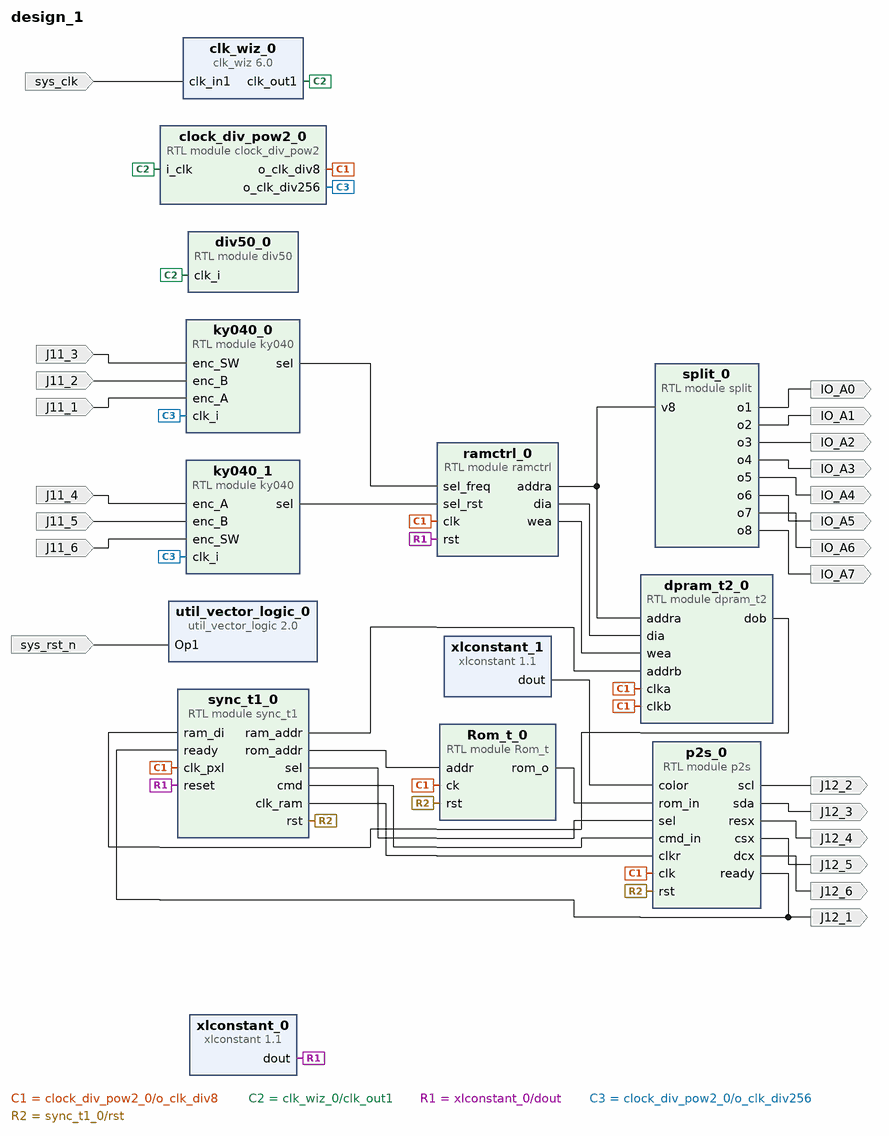
[diagram p0: block diagram of the top level]
# Vivado block design design_1, xc7k325tffg676-1, Vivado 2019.1
create_bd_design design_1

create_bd_port -dir I sys_clk
create_bd_port -dir I sys_rst_n
create_bd_port -dir I J11_1
create_bd_port -dir I J11_2
create_bd_port -dir I J11_3
create_bd_port -dir I J11_4
create_bd_port -dir I J11_5
create_bd_port -dir I J11_6
create_bd_port -dir O IO_A0
create_bd_port -dir O IO_A1
create_bd_port -dir O IO_A2
create_bd_port -dir O IO_A3
create_bd_port -dir O IO_A4
create_bd_port -dir O IO_A5
create_bd_port -dir O IO_A6
create_bd_port -dir O IO_A7
create_bd_port -dir O J12_1
create_bd_port -dir O J12_2
create_bd_port -dir O J12_3
create_bd_port -dir O J12_4
create_bd_port -dir O J12_5
create_bd_port -dir O J12_6

create_bd_cell -type module -reference Rom_t Rom_t_0
create_bd_cell -type module -reference dpram_t2 dpram_t2_0
create_bd_cell -type module -reference ramctrl ramctrl_0
create_bd_cell -type ip -vlnv xilinx.com:ip:clk_wiz:6.0 clk_wiz_0
create_bd_cell -type ip -vlnv xilinx.com:ip:util_vector_logic:2.0 util_vector_logic_0
set_property -dict {CONFIG.C_OPERATION not} [get_bd_cells util_vector_logic_0]
create_bd_cell -type module -reference clock_div_pow2 clock_div_pow2_0
create_bd_cell -type module -reference div50 div50_0
create_bd_cell -type ip -vlnv xilinx.com:ip:xlconstant:1.1 xlconstant_0
set_property -dict {CONFIG.CONST_VAL 0} [get_bd_cells xlconstant_0]
create_bd_cell -type module -reference ky040 ky040_0
create_bd_cell -type module -reference ky040 ky040_1
create_bd_cell -type module -reference split split_0
create_bd_cell -type module -reference p2s p2s_0
create_bd_cell -type ip -vlnv xilinx.com:ip:xlconstant:1.1 xlconstant_1
set_property -dict {CONFIG.CONST_VAL 0 CONFIG.CONST_WIDTH 16} [get_bd_cells xlconstant_1]
create_bd_cell -type module -reference sync_t1 sync_t1_0

# ---- connections ----

connect_bd_net [get_bd_ports sys_clk] [get_bd_pins clk_wiz_0/clk_in1]
connect_bd_net [get_bd_ports sys_rst_n] [get_bd_pins util_vector_logic_0/Op1]
connect_bd_net [get_bd_pins clock_div_pow2_0/o_clk_div8] \
  [get_bd_pins ramctrl_0/clk] [get_bd_pins dpram_t2_0/clka] [get_bd_pins dpram_t2_0/clkb] [get_bd_pins Rom_t_0/ck] \
  [get_bd_pins p2s_0/clk] [get_bd_pins sync_t1_0/clk_pxl]
connect_bd_net [get_bd_pins clk_wiz_0/clk_out1] [get_bd_pins div50_0/clk_i] [get_bd_pins clock_div_pow2_0/i_clk]
connect_bd_net [get_bd_pins xlconstant_0/dout] [get_bd_pins ramctrl_0/rst] [get_bd_pins sync_t1_0/reset]
connect_bd_net -net J11_4_1 [get_bd_ports J11_4] [get_bd_pins ky040_1/enc_A]
connect_bd_net -net J11_5_1 [get_bd_ports J11_5] [get_bd_pins ky040_1/enc_B]
connect_bd_net -net J11_6_1 [get_bd_ports J11_6] [get_bd_pins ky040_1/enc_SW]
connect_bd_net -net J11_3_1 [get_bd_ports J11_3] [get_bd_pins ky040_0/enc_SW]
connect_bd_net -net J11_2_1 [get_bd_ports J11_2] [get_bd_pins ky040_0/enc_B]
connect_bd_net -net J11_1_1 [get_bd_ports J11_1] [get_bd_pins ky040_0/enc_A]
connect_bd_net [get_bd_pins clock_div_pow2_0/o_clk_div256] [get_bd_pins ky040_0/clk_i] [get_bd_pins ky040_1/clk_i]
connect_bd_net [get_bd_pins ky040_0/sel] [get_bd_pins ramctrl_0/sel_freq]
connect_bd_net [get_bd_pins ky040_1/sel] [get_bd_pins ramctrl_0/sel_rst]
connect_bd_net [get_bd_pins ramctrl_0/addra] [get_bd_pins dpram_t2_0/addra] [get_bd_pins split_0/v8]
connect_bd_net [get_bd_pins ramctrl_0/dia] [get_bd_pins dpram_t2_0/dia]
connect_bd_net [get_bd_pins sync_t1_0/ram_addr] [get_bd_pins dpram_t2_0/addrb]
connect_bd_net [get_bd_pins sync_t1_0/rom_addr] [get_bd_pins Rom_t_0/addr]
connect_bd_net [get_bd_pins ramctrl_0/wea] [get_bd_pins dpram_t2_0/wea]
connect_bd_net [get_bd_pins dpram_t2_0/dob] [get_bd_pins sync_t1_0/ram_di]
connect_bd_net [get_bd_pins sync_t1_0/rst] [get_bd_pins Rom_t_0/rst] [get_bd_pins p2s_0/rst]
connect_bd_net [get_bd_pins xlconstant_1/dout] [get_bd_pins p2s_0/color]
connect_bd_net [get_bd_pins sync_t1_0/sel] [get_bd_pins p2s_0/sel]
connect_bd_net [get_bd_pins sync_t1_0/cmd] [get_bd_pins p2s_0/cmd_in]
connect_bd_net [get_bd_pins Rom_t_0/rom_o] [get_bd_pins p2s_0/rom_in]
connect_bd_net [get_bd_pins sync_t1_0/clk_ram] [get_bd_pins p2s_0/clkr]
connect_bd_net [get_bd_pins split_0/o1] [get_bd_ports IO_A0]
connect_bd_net [get_bd_pins split_0/o2] [get_bd_ports IO_A1]
connect_bd_net [get_bd_pins split_0/o3] [get_bd_ports IO_A2]
connect_bd_net [get_bd_pins split_0/o4] [get_bd_ports IO_A3]
connect_bd_net [get_bd_pins split_0/o5] [get_bd_ports IO_A4]
connect_bd_net [get_bd_pins split_0/o6] [get_bd_ports IO_A5]
connect_bd_net [get_bd_pins split_0/o7] [get_bd_ports IO_A6]
connect_bd_net [get_bd_pins split_0/o8] [get_bd_ports IO_A7]
connect_bd_net [get_bd_pins p2s_0/ready] [get_bd_ports J12_1] [get_bd_pins sync_t1_0/ready]
connect_bd_net [get_bd_pins p2s_0/scl] [get_bd_ports J12_2]
connect_bd_net [get_bd_pins p2s_0/resx] [get_bd_ports J12_4]
connect_bd_net [get_bd_pins p2s_0/csx] [get_bd_ports J12_5]
connect_bd_net [get_bd_pins p2s_0/dcx] [get_bd_ports J12_6]
connect_bd_net [get_bd_pins p2s_0/sda] [get_bd_ports J12_3]

validate_bd_design
save_bd_design
